# EAGLE schematic SNES_controller (EAGLE 6.5.0)
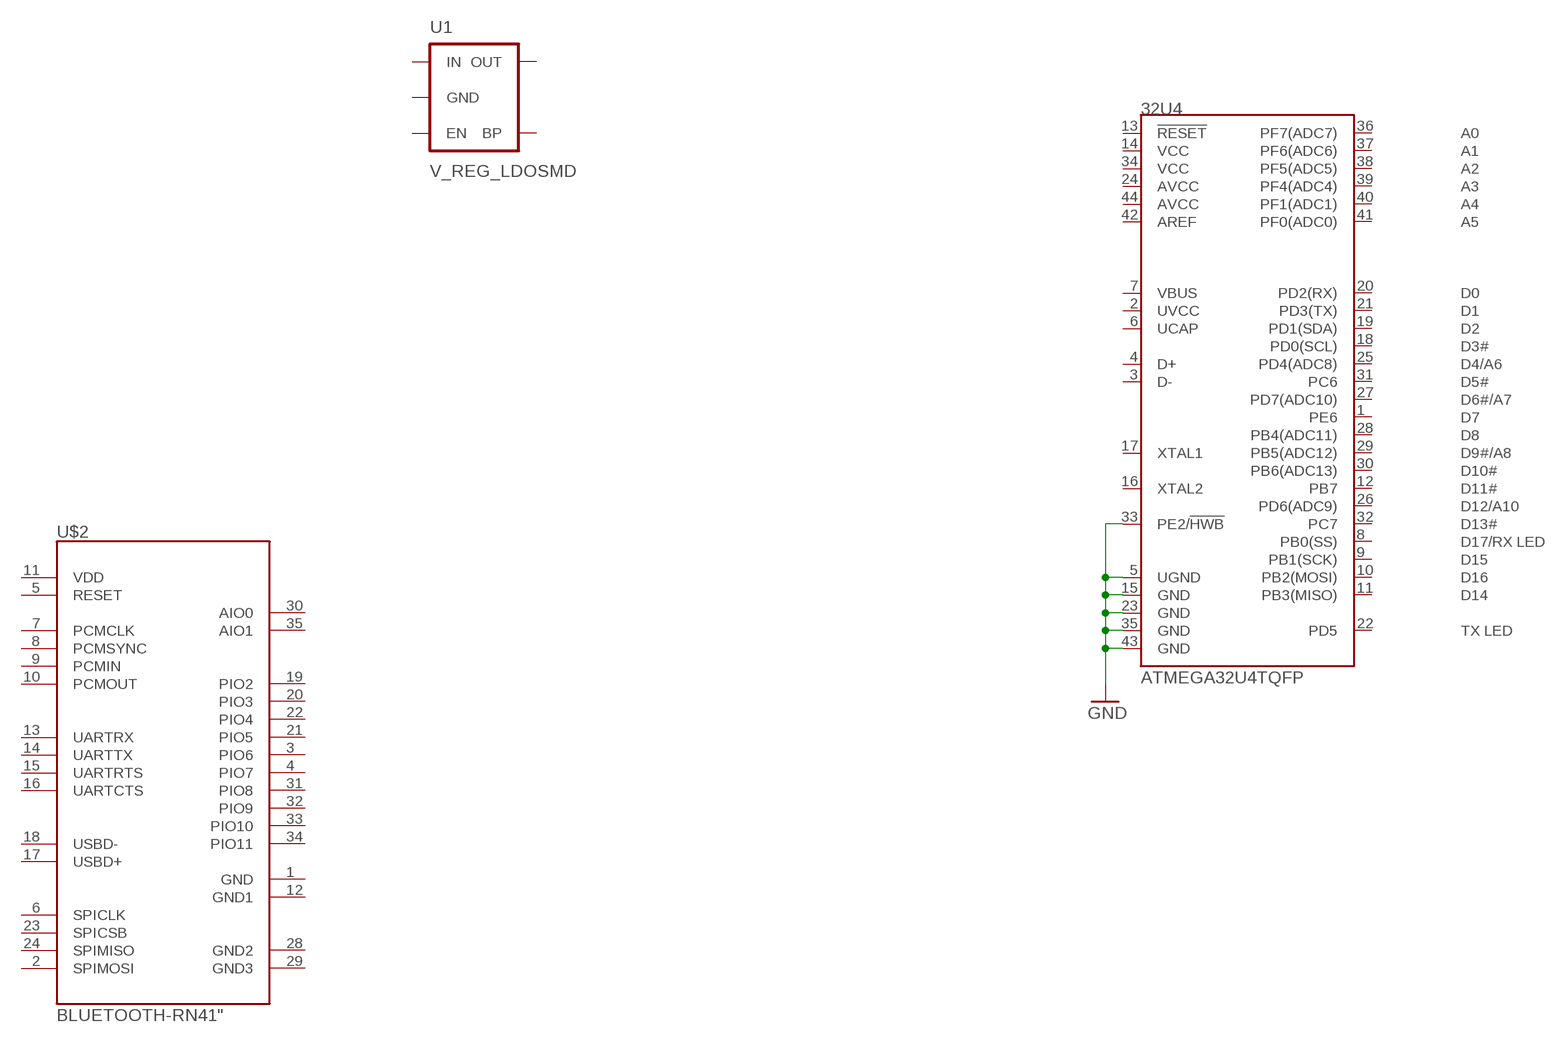
[diagram p0: schematic, sheet 1]

## Parts
32U4  ATMEGA32U4TQFP  [SPARKFUN-DIGITALIC_TQFP44]
U1  V_REG_LDOSMD  [SOT23-5]
U$2  BLUETOOTH-RN41"  [RN41]

## Nets
GND: 32U4.5(UGND) 32U4.15(GND) 32U4.23(GND) 32U4.33(PE2/!HWB) 32U4.35(GND) 32U4.43(GND)
Unconnected: 32U4.1(PE6) 32U4.2(UVCC) 32U4.3(D-) 32U4.4(D+) 32U4.6(UCAP) 32U4.7(VBUS) 32U4.8(PB0(SS)) 32U4.9(PB1(SCK)) 32U4.10(PB2(MOSI)) 32U4.11(PB3(MISO)) 32U4.12(PB7) 32U4.13(!RESET) 32U4.14(VCC) 32U4.16(XTAL2) 32U4.17(XTAL1) 32U4.18(PD0(SCL)) 32U4.19(PD1(SDA)) 32U4.20(PD2(RX)) 32U4.21(PD3(TX)) 32U4.22(PD5) 32U4.24(AVCC) 32U4.25(PD4(ADC8)) 32U4.26(PD6(ADC9)) 32U4.27(PD7(ADC10)) 32U4.28(PB4(ADC11)) 32U4.29(PB5(ADC12)) 32U4.30(PB6(ADC13)) 32U4.31(PC6) 32U4.32(PC7) 32U4.34(VCC) 32U4.36(PF7(ADC7)) 32U4.37(PF6(ADC6)) 32U4.38(PF5(ADC5)) 32U4.39(PF4(ADC4)) 32U4.40(PF1(ADC1)) 32U4.41(PF0(ADC0)) 32U4.42(AREF) 32U4.44(AVCC) U1.1(IN) U1.2(GND) U1.3(EN) U1.4(BP) U1.5(OUT) U$2.1(GND) U$2.2(SPIMOSI) U$2.3(PIO6) U$2.4(PIO7) U$2.5(RESET) U$2.6(SPICLK) U$2.7(PCMCLK) U$2.8(PCMSYNC) U$2.9(PCMIN) U$2.10(PCMOUT) U$2.11(VDD) U$2.12(GND1) U$2.13(UARTRX) U$2.14(UARTTX) U$2.15(UARTRTS) U$2.16(UARTCTS) U$2.17(USBD+) U$2.18(USBD-) U$2.19(PIO2) U$2.20(PIO3) U$2.21(PIO5) U$2.22(PIO4) U$2.23(SPICSB) U$2.24(SPIMISO) U$2.28(GND2) U$2.29(GND3) U$2.30(AIO0) U$2.31(PIO8) U$2.32(PIO9) U$2.33(PIO10) U$2.34(PIO11) U$2.35(AIO1)

## Library data of the parts
32U4 = SparkFun-DigitalIC:ATMEGA32U4: Atmel 44-pin 8-bit Microcontroller with 32KBytes of ISP Flash and USB Controller ----- Please use the QFN-44-NOPAD_1:1 package for the footprint of all boards using a 32U4. Route traces directly away from the pads as much as possible.; PROD_ID: IC-11161
U1 = SparkFun-PowerIC:V_REG_LDO: Voltage Regulator LDO Standard 150mA LDO voltage regulator in SOT-23 layout. Micrel part MIC5205. BP (by-pass) pin is used to lower output noise with 470pF cap.
U$2 = SparkFun-RF:BLUETOOTH-RN41: Bluetooth SMD module